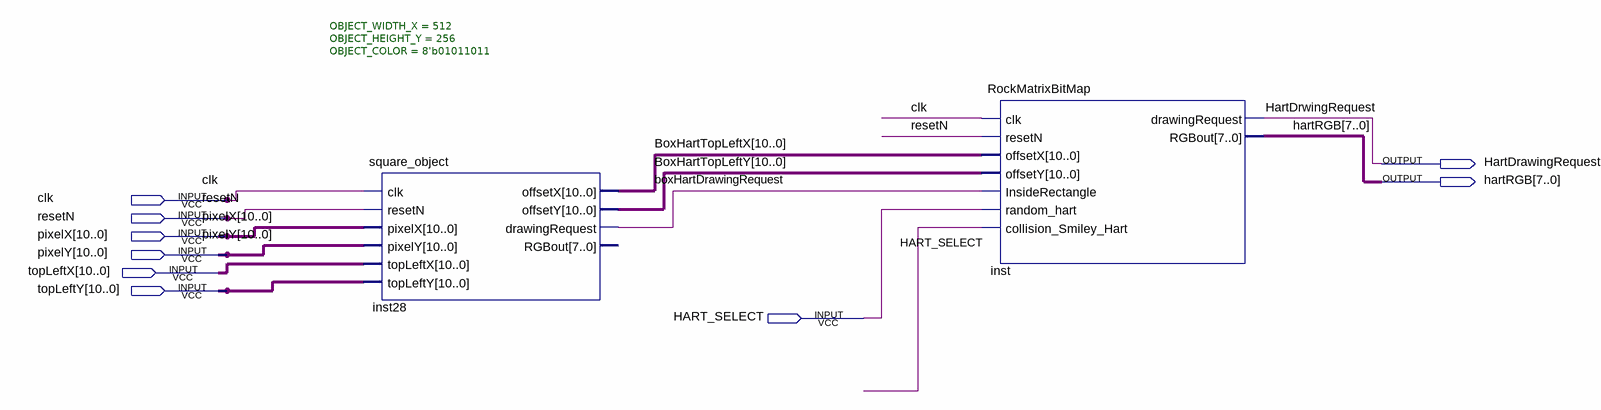
[diagram p0: schematic sheet]
// Quartus schematic ROCK_DISPLAY.bdf as structural Verilog: 2 symbols, 9 pins
module ROCK_DISPLAY (
  input  clk,
  input  resetN,
  input  [10:0] pixelX,
  input  [10:0] pixelY,
  input  [10:0] topLeftX,
  input  [10:0] topLeftY,
  input  HART_SELECT,
  output HartDrawingRequest,
  output [7:0] hartRGB
);

  wire boxHartDrawingRequest, undriven;
  wire [10:0] BoxHartTopLeftX, BoxHartTopLeftY;

  square_object #(.OBJECT_WIDTH_X(512), .OBJECT_HEIGHT_Y(256), .OBJECT_COLOR(8'b01011011)) inst28 (
    .clk(clk), .resetN(resetN), .pixelX(pixelX), .pixelY(pixelY), .topLeftX(topLeftX), .topLeftY(topLeftY),
    .offsetX(BoxHartTopLeftX), .offsetY(BoxHartTopLeftY), .drawingRequest(boxHartDrawingRequest));  // open: RGBout
  RockMatrixBitMap inst (
    .clk(clk), .resetN(resetN), .offsetX(BoxHartTopLeftX), .offsetY(BoxHartTopLeftY),
    .InsideRectangle(boxHartDrawingRequest), .random_hart(HART_SELECT), .collision_Smiley_Hart(undriven),
    .drawingRequest(HartDrawingRequest), .RGBout(hartRGB));

  // Other names for the same wires on the sheet: HartDrwingRequest = HartDrawingRequest
endmodule
